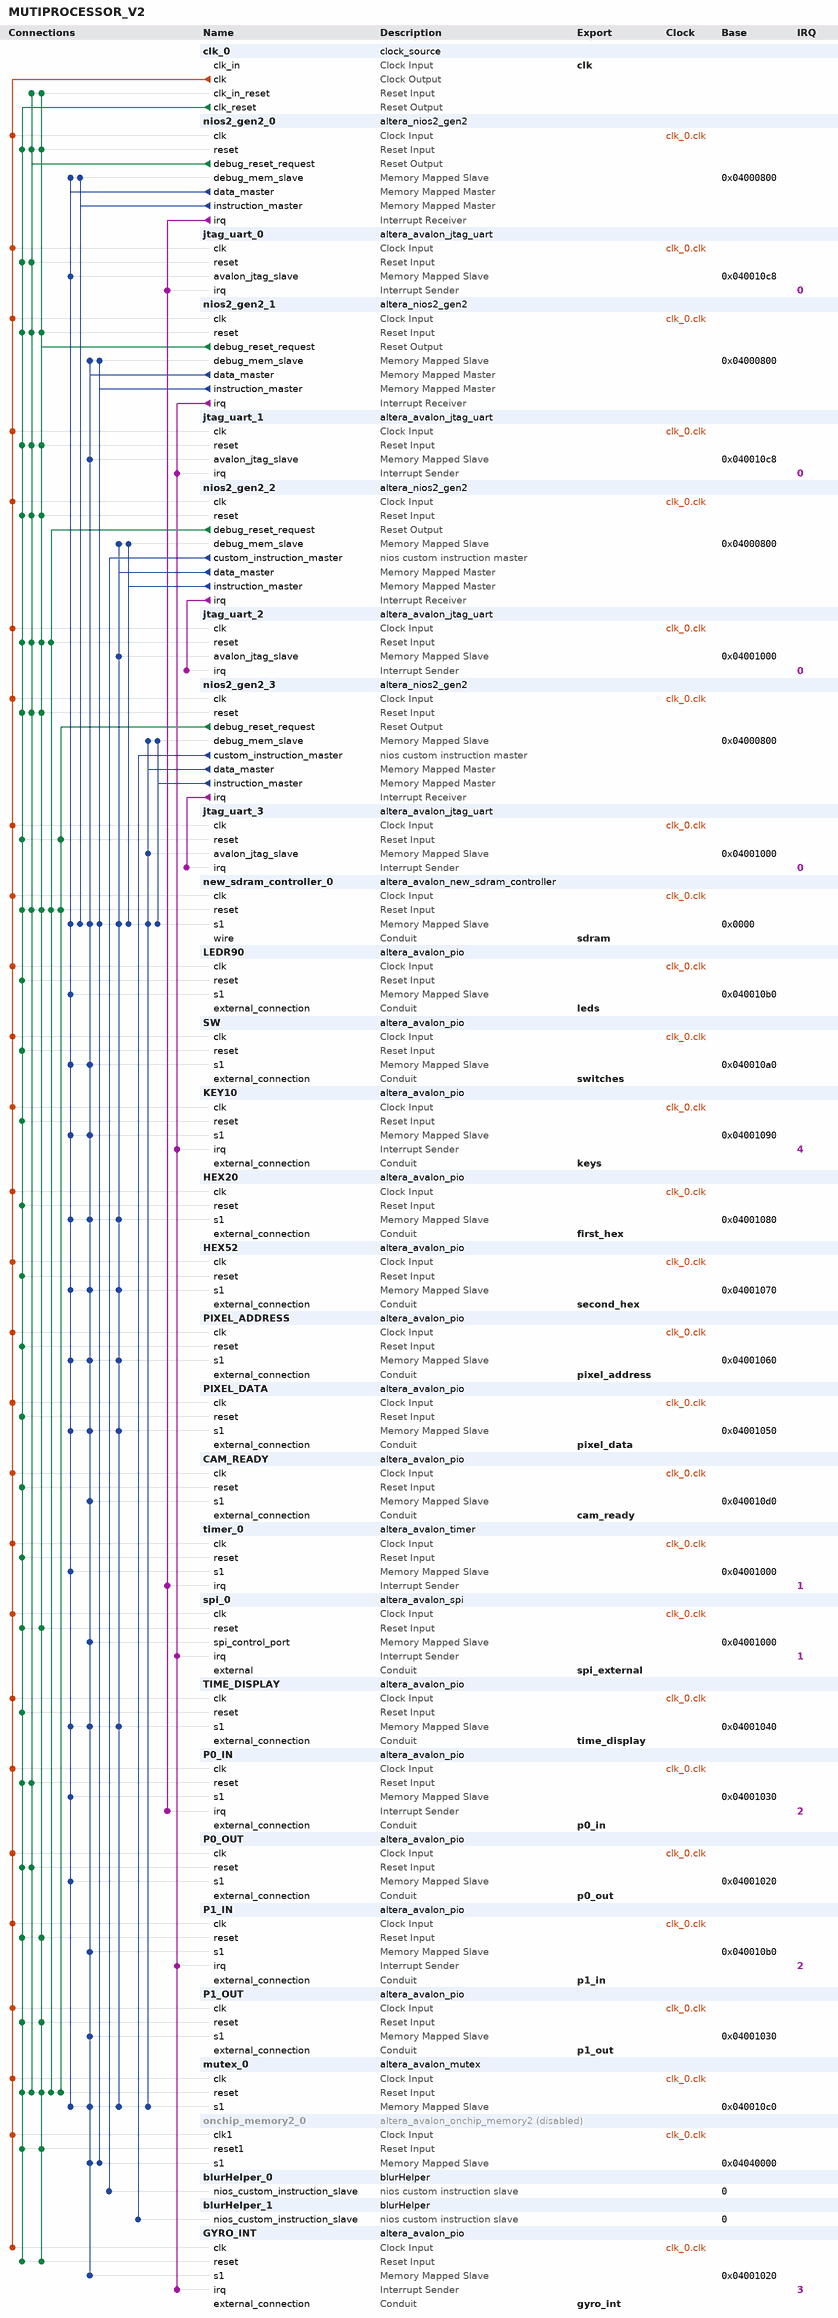
[diagram p0: system contents]
# Platform Designer (Qsys) system MUTIPROCESSOR_V2, MAX 10 10M50DAF484C7G
# Parameters at their usual value, and those the tool derives, are not listed.
package require -exact qsys 18.1
create_system MUTIPROCESSOR_V2
set_project_property DEVICE_FAMILY {MAX 10}
set_project_property DEVICE 10M50DAF484C7G

add_instance clk_0 clock_source 18.1
set_instance_parameter_value clk_0 clockFrequency 50000000

add_instance nios2_gen2_0 altera_nios2_gen2 18.1
set_instance_parameter_value nios2_gen2_0 dcache_size 16384
set_instance_parameter_value nios2_gen2_0 exceptionSlave new_sdram_controller_0.s1
set_instance_parameter_value nios2_gen2_0 icache_size 16384
set_instance_parameter_value nios2_gen2_0 impl Fast
set_instance_parameter_value nios2_gen2_0 resetSlave new_sdram_controller_0.s1

add_instance jtag_uart_0 altera_avalon_jtag_uart 18.1
set_instance_parameter_value jtag_uart_0 readBufferDepth 256
set_instance_parameter_value jtag_uart_0 simInteractiveOptions NO_INTERACTIVE_WINDOWS
set_instance_parameter_value jtag_uart_0 writeBufferDepth 256

add_instance nios2_gen2_1 altera_nios2_gen2 18.1
set_instance_parameter_value nios2_gen2_1 cpuID 1
set_instance_parameter_value nios2_gen2_1 dcache_size 4096
set_instance_parameter_value nios2_gen2_1 exceptionOffset 16777248
set_instance_parameter_value nios2_gen2_1 exceptionSlave new_sdram_controller_0.s1
set_instance_parameter_value nios2_gen2_1 icache_size 2048
set_instance_parameter_value nios2_gen2_1 impl Fast
set_instance_parameter_value nios2_gen2_1 resetOffset 16777216
set_instance_parameter_value nios2_gen2_1 resetSlave new_sdram_controller_0.s1

add_instance jtag_uart_1 altera_avalon_jtag_uart 18.1
set_instance_parameter_value jtag_uart_1 readBufferDepth 256
set_instance_parameter_value jtag_uart_1 simInteractiveOptions NO_INTERACTIVE_WINDOWS
set_instance_parameter_value jtag_uart_1 writeBufferDepth 256

add_instance nios2_gen2_2 altera_nios2_gen2 18.1
set_instance_parameter_value nios2_gen2_2 cpuID 2
set_instance_parameter_value nios2_gen2_2 dcache_size 8192
set_instance_parameter_value nios2_gen2_2 exceptionOffset 20971552
set_instance_parameter_value nios2_gen2_2 exceptionSlave new_sdram_controller_0.s1
set_instance_parameter_value nios2_gen2_2 icache_size 4096
set_instance_parameter_value nios2_gen2_2 impl Fast
set_instance_parameter_value nios2_gen2_2 resetOffset 20971520
set_instance_parameter_value nios2_gen2_2 resetSlave new_sdram_controller_0.s1

add_instance jtag_uart_2 altera_avalon_jtag_uart 18.1
set_instance_parameter_value jtag_uart_2 readBufferDepth 256
set_instance_parameter_value jtag_uart_2 simInteractiveOptions NO_INTERACTIVE_WINDOWS
set_instance_parameter_value jtag_uart_2 writeBufferDepth 256

add_instance nios2_gen2_3 altera_nios2_gen2 18.1
set_instance_parameter_value nios2_gen2_3 cpuID 3
set_instance_parameter_value nios2_gen2_3 dcache_size 8192
set_instance_parameter_value nios2_gen2_3 exceptionOffset 29360160
set_instance_parameter_value nios2_gen2_3 exceptionSlave new_sdram_controller_0.s1
set_instance_parameter_value nios2_gen2_3 icache_size 4096
set_instance_parameter_value nios2_gen2_3 impl Fast
set_instance_parameter_value nios2_gen2_3 resetOffset 29360128
set_instance_parameter_value nios2_gen2_3 resetSlave new_sdram_controller_0.s1

add_instance jtag_uart_3 altera_avalon_jtag_uart 18.1
set_instance_parameter_value jtag_uart_3 readBufferDepth 256
set_instance_parameter_value jtag_uart_3 simInteractiveOptions NO_INTERACTIVE_WINDOWS
set_instance_parameter_value jtag_uart_3 writeBufferDepth 256

add_instance new_sdram_controller_0 altera_avalon_new_sdram_controller 18.1
set_instance_parameter_value new_sdram_controller_0 TAC 5.5
set_instance_parameter_value new_sdram_controller_0 TRCD 20.0
set_instance_parameter_value new_sdram_controller_0 TRP 20.0
set_instance_parameter_value new_sdram_controller_0 casLatency 1
set_instance_parameter_value new_sdram_controller_0 columnWidth 10
set_instance_parameter_value new_sdram_controller_0 dataWidth 16
set_instance_parameter_value new_sdram_controller_0 generateSimulationModel false
set_instance_parameter_value new_sdram_controller_0 model single_Micron_MT48LC4M32B2_7_chip
set_instance_parameter_value new_sdram_controller_0 numberOfBanks 4
set_instance_parameter_value new_sdram_controller_0 numberOfChipSelects 1
set_instance_parameter_value new_sdram_controller_0 powerUpDelay 100.0
set_instance_parameter_value new_sdram_controller_0 refreshPeriod 15.625
set_instance_parameter_value new_sdram_controller_0 rowWidth 13

add_instance LEDR90 altera_avalon_pio 18.1
set_instance_parameter_value LEDR90 direction Output
set_instance_parameter_value LEDR90 width 10

add_instance SW altera_avalon_pio 18.1
set_instance_parameter_value SW direction Input
set_instance_parameter_value SW width 10

add_instance KEY10 altera_avalon_pio 18.1
set_instance_parameter_value KEY10 captureEdge true
set_instance_parameter_value KEY10 direction Input
set_instance_parameter_value KEY10 edgeType FALLING
set_instance_parameter_value KEY10 generateIRQ true
set_instance_parameter_value KEY10 irqType EDGE
set_instance_parameter_value KEY10 width 2

add_instance HEX20 altera_avalon_pio 18.1
set_instance_parameter_value HEX20 direction Output
set_instance_parameter_value HEX20 width 24

add_instance HEX52 altera_avalon_pio 18.1
set_instance_parameter_value HEX52 direction Output
set_instance_parameter_value HEX52 width 24

add_instance PIXEL_ADDRESS altera_avalon_pio 18.1
set_instance_parameter_value PIXEL_ADDRESS direction Output
set_instance_parameter_value PIXEL_ADDRESS width 17

add_instance PIXEL_DATA altera_avalon_pio 18.1
set_instance_parameter_value PIXEL_DATA direction Output
set_instance_parameter_value PIXEL_DATA width 4

add_instance CAM_READY altera_avalon_pio 18.1
set_instance_parameter_value CAM_READY direction Input
set_instance_parameter_value CAM_READY width 1

add_instance timer_0 altera_avalon_timer 18.1
set_instance_parameter_value timer_0 period 1
set_instance_parameter_value timer_0 periodUnits MSEC

add_instance spi_0 altera_avalon_spi 18.1
set_instance_parameter_value spi_0 clockPhase 1
set_instance_parameter_value spi_0 clockPolarity 1
set_instance_parameter_value spi_0 dataWidth 8
set_instance_parameter_value spi_0 masterSPI true
set_instance_parameter_value spi_0 numberOfSlaves 2
set_instance_parameter_value spi_0 targetClockRate 5000000

add_instance TIME_DISPLAY altera_avalon_pio 18.1
set_instance_parameter_value TIME_DISPLAY direction Input
set_instance_parameter_value TIME_DISPLAY width 32

add_instance P0_IN altera_avalon_pio 18.1
set_instance_parameter_value P0_IN bitClearingEdgeCapReg true
set_instance_parameter_value P0_IN captureEdge true
set_instance_parameter_value P0_IN direction Input
set_instance_parameter_value P0_IN generateIRQ true
set_instance_parameter_value P0_IN irqType EDGE
set_instance_parameter_value P0_IN width 1

add_instance P0_OUT altera_avalon_pio 18.1
set_instance_parameter_value P0_OUT direction Output
set_instance_parameter_value P0_OUT width 1

add_instance P1_IN altera_avalon_pio 18.1
set_instance_parameter_value P1_IN bitClearingEdgeCapReg true
set_instance_parameter_value P1_IN captureEdge true
set_instance_parameter_value P1_IN direction Input
set_instance_parameter_value P1_IN generateIRQ true
set_instance_parameter_value P1_IN irqType EDGE
set_instance_parameter_value P1_IN width 1

add_instance P1_OUT altera_avalon_pio 18.1
set_instance_parameter_value P1_OUT direction Output
set_instance_parameter_value P1_OUT width 1

add_instance mutex_0 altera_avalon_mutex 18.1

add_instance onchip_memory2_0 altera_avalon_onchip_memory2 18.1
set_instance_property onchip_memory2_0 ENABLED false
set_instance_parameter_value onchip_memory2_0 dataWidth 32
set_instance_parameter_value onchip_memory2_0 dualPort false
set_instance_parameter_value onchip_memory2_0 initMemContent false
set_instance_parameter_value onchip_memory2_0 initializationFileName onchip_mem.hex
set_instance_parameter_value onchip_memory2_0 memorySize 102400

add_instance blurHelper_0 blurHelper 1.0

add_instance blurHelper_1 blurHelper 1.0

add_instance GYRO_INT altera_avalon_pio 18.1
set_instance_parameter_value GYRO_INT captureEdge true
set_instance_parameter_value GYRO_INT direction Input
set_instance_parameter_value GYRO_INT generateIRQ true
set_instance_parameter_value GYRO_INT irqType EDGE
set_instance_parameter_value GYRO_INT width 1

# connections
add_connection clk_0.clk CAM_READY.clk clock
add_connection clk_0.clk GYRO_INT.clk clock
add_connection clk_0.clk HEX20.clk clock
add_connection clk_0.clk HEX52.clk clock
add_connection clk_0.clk jtag_uart_0.clk clock
add_connection clk_0.clk jtag_uart_1.clk clock
add_connection clk_0.clk jtag_uart_2.clk clock
add_connection clk_0.clk jtag_uart_3.clk clock
add_connection clk_0.clk KEY10.clk clock
add_connection clk_0.clk LEDR90.clk clock
add_connection clk_0.clk mutex_0.clk clock
add_connection clk_0.clk new_sdram_controller_0.clk clock
add_connection clk_0.clk nios2_gen2_0.clk clock
add_connection clk_0.clk nios2_gen2_1.clk clock
add_connection clk_0.clk nios2_gen2_2.clk clock
add_connection clk_0.clk nios2_gen2_3.clk clock
add_connection clk_0.clk onchip_memory2_0.clk1 clock
add_connection clk_0.clk P0_IN.clk clock
add_connection clk_0.clk P0_OUT.clk clock
add_connection clk_0.clk P1_IN.clk clock
add_connection clk_0.clk P1_OUT.clk clock
add_connection clk_0.clk PIXEL_ADDRESS.clk clock
add_connection clk_0.clk PIXEL_DATA.clk clock
add_connection clk_0.clk spi_0.clk clock
add_connection clk_0.clk SW.clk clock
add_connection clk_0.clk TIME_DISPLAY.clk clock
add_connection clk_0.clk timer_0.clk clock
add_connection clk_0.clk_reset CAM_READY.reset reset
add_connection clk_0.clk_reset GYRO_INT.reset reset
add_connection clk_0.clk_reset HEX20.reset reset
add_connection clk_0.clk_reset HEX52.reset reset
add_connection clk_0.clk_reset jtag_uart_0.reset reset
add_connection clk_0.clk_reset jtag_uart_1.reset reset
add_connection clk_0.clk_reset jtag_uart_2.reset reset
add_connection clk_0.clk_reset jtag_uart_3.reset reset
add_connection clk_0.clk_reset KEY10.reset reset
add_connection clk_0.clk_reset LEDR90.reset reset
add_connection clk_0.clk_reset mutex_0.reset reset
add_connection clk_0.clk_reset new_sdram_controller_0.reset reset
add_connection clk_0.clk_reset nios2_gen2_0.reset reset
add_connection clk_0.clk_reset nios2_gen2_1.reset reset
add_connection clk_0.clk_reset nios2_gen2_2.reset reset
add_connection clk_0.clk_reset nios2_gen2_3.reset reset
add_connection clk_0.clk_reset onchip_memory2_0.reset1 reset
add_connection clk_0.clk_reset P0_IN.reset reset
add_connection clk_0.clk_reset P0_OUT.reset reset
add_connection clk_0.clk_reset P1_IN.reset reset
add_connection clk_0.clk_reset P1_OUT.reset reset
add_connection clk_0.clk_reset PIXEL_ADDRESS.reset reset
add_connection clk_0.clk_reset PIXEL_DATA.reset reset
add_connection clk_0.clk_reset spi_0.reset reset
add_connection clk_0.clk_reset SW.reset reset
add_connection clk_0.clk_reset TIME_DISPLAY.reset reset
add_connection clk_0.clk_reset timer_0.reset reset
add_connection nios2_gen2_0.debug_reset_request clk_0.clk_in_reset reset
add_connection nios2_gen2_0.debug_reset_request jtag_uart_0.reset reset
add_connection nios2_gen2_0.debug_reset_request jtag_uart_1.reset reset
add_connection nios2_gen2_0.debug_reset_request jtag_uart_2.reset reset
add_connection nios2_gen2_0.debug_reset_request mutex_0.reset reset
add_connection nios2_gen2_0.debug_reset_request new_sdram_controller_0.reset reset
add_connection nios2_gen2_0.debug_reset_request nios2_gen2_0.reset reset
add_connection nios2_gen2_0.debug_reset_request nios2_gen2_1.reset reset
add_connection nios2_gen2_0.debug_reset_request nios2_gen2_2.reset reset
add_connection nios2_gen2_0.debug_reset_request nios2_gen2_3.reset reset
add_connection nios2_gen2_0.debug_reset_request P0_IN.reset reset
add_connection nios2_gen2_0.debug_reset_request P0_OUT.reset reset
add_connection nios2_gen2_1.debug_reset_request clk_0.clk_in_reset reset
add_connection nios2_gen2_1.debug_reset_request GYRO_INT.reset reset
add_connection nios2_gen2_1.debug_reset_request jtag_uart_1.reset reset
add_connection nios2_gen2_1.debug_reset_request jtag_uart_2.reset reset
add_connection nios2_gen2_1.debug_reset_request mutex_0.reset reset
add_connection nios2_gen2_1.debug_reset_request new_sdram_controller_0.reset reset
add_connection nios2_gen2_1.debug_reset_request nios2_gen2_0.reset reset
add_connection nios2_gen2_1.debug_reset_request nios2_gen2_1.reset reset
add_connection nios2_gen2_1.debug_reset_request nios2_gen2_2.reset reset
add_connection nios2_gen2_1.debug_reset_request nios2_gen2_3.reset reset
add_connection nios2_gen2_1.debug_reset_request onchip_memory2_0.reset1 reset
add_connection nios2_gen2_1.debug_reset_request P1_IN.reset reset
add_connection nios2_gen2_1.debug_reset_request P1_OUT.reset reset
add_connection nios2_gen2_1.debug_reset_request spi_0.reset reset
add_connection nios2_gen2_2.debug_reset_request jtag_uart_2.reset reset
add_connection nios2_gen2_2.debug_reset_request mutex_0.reset reset
add_connection nios2_gen2_2.debug_reset_request new_sdram_controller_0.reset reset
add_connection nios2_gen2_3.debug_reset_request jtag_uart_3.reset reset
add_connection nios2_gen2_3.debug_reset_request mutex_0.reset reset
add_connection nios2_gen2_3.debug_reset_request new_sdram_controller_0.reset reset
add_connection nios2_gen2_0.data_master HEX20.s1 avalon
set_connection_parameter_value nios2_gen2_0.data_master/HEX20.s1 baseAddress 0x04001080
add_connection nios2_gen2_0.data_master HEX52.s1 avalon
set_connection_parameter_value nios2_gen2_0.data_master/HEX52.s1 baseAddress 0x04001070
add_connection nios2_gen2_0.data_master jtag_uart_0.avalon_jtag_slave avalon
set_connection_parameter_value nios2_gen2_0.data_master/jtag_uart_0.avalon_jtag_slave baseAddress 0x040010c8
add_connection nios2_gen2_0.data_master KEY10.s1 avalon
set_connection_parameter_value nios2_gen2_0.data_master/KEY10.s1 baseAddress 0x04001090
add_connection nios2_gen2_0.data_master LEDR90.s1 avalon
set_connection_parameter_value nios2_gen2_0.data_master/LEDR90.s1 baseAddress 0x040010b0
add_connection nios2_gen2_0.data_master mutex_0.s1 avalon
set_connection_parameter_value nios2_gen2_0.data_master/mutex_0.s1 baseAddress 0x040010c0
add_connection nios2_gen2_0.data_master new_sdram_controller_0.s1 avalon
set_connection_parameter_value nios2_gen2_0.data_master/new_sdram_controller_0.s1 baseAddress 0x0000
add_connection nios2_gen2_0.data_master nios2_gen2_0.debug_mem_slave avalon
set_connection_parameter_value nios2_gen2_0.data_master/nios2_gen2_0.debug_mem_slave baseAddress 0x04000800
add_connection nios2_gen2_0.data_master P0_IN.s1 avalon
set_connection_parameter_value nios2_gen2_0.data_master/P0_IN.s1 baseAddress 0x04001030
add_connection nios2_gen2_0.data_master P0_OUT.s1 avalon
set_connection_parameter_value nios2_gen2_0.data_master/P0_OUT.s1 baseAddress 0x04001020
add_connection nios2_gen2_0.data_master PIXEL_ADDRESS.s1 avalon
set_connection_parameter_value nios2_gen2_0.data_master/PIXEL_ADDRESS.s1 baseAddress 0x04001060
add_connection nios2_gen2_0.data_master PIXEL_DATA.s1 avalon
set_connection_parameter_value nios2_gen2_0.data_master/PIXEL_DATA.s1 baseAddress 0x04001050
add_connection nios2_gen2_0.data_master SW.s1 avalon
set_connection_parameter_value nios2_gen2_0.data_master/SW.s1 baseAddress 0x040010a0
add_connection nios2_gen2_0.data_master TIME_DISPLAY.s1 avalon
set_connection_parameter_value nios2_gen2_0.data_master/TIME_DISPLAY.s1 baseAddress 0x04001040
add_connection nios2_gen2_0.data_master timer_0.s1 avalon
set_connection_parameter_value nios2_gen2_0.data_master/timer_0.s1 baseAddress 0x04001000
add_connection nios2_gen2_0.instruction_master new_sdram_controller_0.s1 avalon
set_connection_parameter_value nios2_gen2_0.instruction_master/new_sdram_controller_0.s1 baseAddress 0x0000
add_connection nios2_gen2_0.instruction_master nios2_gen2_0.debug_mem_slave avalon
set_connection_parameter_value nios2_gen2_0.instruction_master/nios2_gen2_0.debug_mem_slave baseAddress 0x04000800
add_connection nios2_gen2_1.data_master CAM_READY.s1 avalon
set_connection_parameter_value nios2_gen2_1.data_master/CAM_READY.s1 baseAddress 0x040010d0
add_connection nios2_gen2_1.data_master GYRO_INT.s1 avalon
set_connection_parameter_value nios2_gen2_1.data_master/GYRO_INT.s1 baseAddress 0x04001020
add_connection nios2_gen2_1.data_master HEX20.s1 avalon
set_connection_parameter_value nios2_gen2_1.data_master/HEX20.s1 baseAddress 0x04001080
add_connection nios2_gen2_1.data_master HEX52.s1 avalon
set_connection_parameter_value nios2_gen2_1.data_master/HEX52.s1 baseAddress 0x04001070
add_connection nios2_gen2_1.data_master jtag_uart_1.avalon_jtag_slave avalon
set_connection_parameter_value nios2_gen2_1.data_master/jtag_uart_1.avalon_jtag_slave baseAddress 0x040010c8
add_connection nios2_gen2_1.data_master KEY10.s1 avalon
set_connection_parameter_value nios2_gen2_1.data_master/KEY10.s1 baseAddress 0x04001090
add_connection nios2_gen2_1.data_master mutex_0.s1 avalon
set_connection_parameter_value nios2_gen2_1.data_master/mutex_0.s1 baseAddress 0x040010c0
add_connection nios2_gen2_1.data_master new_sdram_controller_0.s1 avalon
set_connection_parameter_value nios2_gen2_1.data_master/new_sdram_controller_0.s1 baseAddress 0x0000
add_connection nios2_gen2_1.data_master nios2_gen2_1.debug_mem_slave avalon
set_connection_parameter_value nios2_gen2_1.data_master/nios2_gen2_1.debug_mem_slave baseAddress 0x04000800
add_connection nios2_gen2_1.data_master onchip_memory2_0.s1 avalon
set_connection_parameter_value nios2_gen2_1.data_master/onchip_memory2_0.s1 baseAddress 0x04040000
add_connection nios2_gen2_1.data_master P1_IN.s1 avalon
set_connection_parameter_value nios2_gen2_1.data_master/P1_IN.s1 baseAddress 0x040010b0
add_connection nios2_gen2_1.data_master P1_OUT.s1 avalon
set_connection_parameter_value nios2_gen2_1.data_master/P1_OUT.s1 baseAddress 0x04001030
add_connection nios2_gen2_1.data_master PIXEL_ADDRESS.s1 avalon
set_connection_parameter_value nios2_gen2_1.data_master/PIXEL_ADDRESS.s1 baseAddress 0x04001060
add_connection nios2_gen2_1.data_master PIXEL_DATA.s1 avalon
set_connection_parameter_value nios2_gen2_1.data_master/PIXEL_DATA.s1 baseAddress 0x04001050
add_connection nios2_gen2_1.data_master spi_0.spi_control_port avalon
set_connection_parameter_value nios2_gen2_1.data_master/spi_0.spi_control_port baseAddress 0x04001000
add_connection nios2_gen2_1.data_master SW.s1 avalon
set_connection_parameter_value nios2_gen2_1.data_master/SW.s1 baseAddress 0x040010a0
add_connection nios2_gen2_1.data_master TIME_DISPLAY.s1 avalon
set_connection_parameter_value nios2_gen2_1.data_master/TIME_DISPLAY.s1 baseAddress 0x04001040
add_connection nios2_gen2_1.instruction_master new_sdram_controller_0.s1 avalon
set_connection_parameter_value nios2_gen2_1.instruction_master/new_sdram_controller_0.s1 baseAddress 0x0000
add_connection nios2_gen2_1.instruction_master nios2_gen2_1.debug_mem_slave avalon
set_connection_parameter_value nios2_gen2_1.instruction_master/nios2_gen2_1.debug_mem_slave baseAddress 0x04000800
add_connection nios2_gen2_1.instruction_master onchip_memory2_0.s1 avalon
set_connection_parameter_value nios2_gen2_1.instruction_master/onchip_memory2_0.s1 baseAddress 0x04040000
add_connection nios2_gen2_2.data_master HEX20.s1 avalon
set_connection_parameter_value nios2_gen2_2.data_master/HEX20.s1 baseAddress 0x04001080
add_connection nios2_gen2_2.data_master HEX52.s1 avalon
set_connection_parameter_value nios2_gen2_2.data_master/HEX52.s1 baseAddress 0x04001070
add_connection nios2_gen2_2.data_master jtag_uart_2.avalon_jtag_slave avalon
set_connection_parameter_value nios2_gen2_2.data_master/jtag_uart_2.avalon_jtag_slave baseAddress 0x04001000
add_connection nios2_gen2_2.data_master mutex_0.s1 avalon
set_connection_parameter_value nios2_gen2_2.data_master/mutex_0.s1 baseAddress 0x040010c0
add_connection nios2_gen2_2.data_master new_sdram_controller_0.s1 avalon
set_connection_parameter_value nios2_gen2_2.data_master/new_sdram_controller_0.s1 baseAddress 0x0000
add_connection nios2_gen2_2.data_master nios2_gen2_2.debug_mem_slave avalon
set_connection_parameter_value nios2_gen2_2.data_master/nios2_gen2_2.debug_mem_slave baseAddress 0x04000800
add_connection nios2_gen2_2.data_master PIXEL_ADDRESS.s1 avalon
set_connection_parameter_value nios2_gen2_2.data_master/PIXEL_ADDRESS.s1 baseAddress 0x04001060
add_connection nios2_gen2_2.data_master PIXEL_DATA.s1 avalon
set_connection_parameter_value nios2_gen2_2.data_master/PIXEL_DATA.s1 baseAddress 0x04001050
add_connection nios2_gen2_2.data_master TIME_DISPLAY.s1 avalon
set_connection_parameter_value nios2_gen2_2.data_master/TIME_DISPLAY.s1 baseAddress 0x04001040
add_connection nios2_gen2_2.instruction_master new_sdram_controller_0.s1 avalon
set_connection_parameter_value nios2_gen2_2.instruction_master/new_sdram_controller_0.s1 baseAddress 0x0000
add_connection nios2_gen2_2.instruction_master nios2_gen2_2.debug_mem_slave avalon
set_connection_parameter_value nios2_gen2_2.instruction_master/nios2_gen2_2.debug_mem_slave baseAddress 0x04000800
add_connection nios2_gen2_3.data_master jtag_uart_3.avalon_jtag_slave avalon
set_connection_parameter_value nios2_gen2_3.data_master/jtag_uart_3.avalon_jtag_slave baseAddress 0x04001000
add_connection nios2_gen2_3.data_master mutex_0.s1 avalon
set_connection_parameter_value nios2_gen2_3.data_master/mutex_0.s1 baseAddress 0x040010c0
add_connection nios2_gen2_3.data_master new_sdram_controller_0.s1 avalon
set_connection_parameter_value nios2_gen2_3.data_master/new_sdram_controller_0.s1 baseAddress 0x0000
add_connection nios2_gen2_3.data_master nios2_gen2_3.debug_mem_slave avalon
set_connection_parameter_value nios2_gen2_3.data_master/nios2_gen2_3.debug_mem_slave baseAddress 0x04000800
add_connection nios2_gen2_3.instruction_master new_sdram_controller_0.s1 avalon
set_connection_parameter_value nios2_gen2_3.instruction_master/new_sdram_controller_0.s1 baseAddress 0x0000
add_connection nios2_gen2_3.instruction_master nios2_gen2_3.debug_mem_slave avalon
set_connection_parameter_value nios2_gen2_3.instruction_master/nios2_gen2_3.debug_mem_slave baseAddress 0x04000800
add_connection nios2_gen2_0.irq jtag_uart_0.irq interrupt
set_connection_parameter_value nios2_gen2_0.irq/jtag_uart_0.irq irqNumber 0
add_connection nios2_gen2_0.irq P0_IN.irq interrupt
set_connection_parameter_value nios2_gen2_0.irq/P0_IN.irq irqNumber 2
add_connection nios2_gen2_0.irq timer_0.irq interrupt
set_connection_parameter_value nios2_gen2_0.irq/timer_0.irq irqNumber 1
add_connection nios2_gen2_1.irq GYRO_INT.irq interrupt
set_connection_parameter_value nios2_gen2_1.irq/GYRO_INT.irq irqNumber 3
add_connection nios2_gen2_1.irq jtag_uart_1.irq interrupt
set_connection_parameter_value nios2_gen2_1.irq/jtag_uart_1.irq irqNumber 0
add_connection nios2_gen2_1.irq KEY10.irq interrupt
set_connection_parameter_value nios2_gen2_1.irq/KEY10.irq irqNumber 4
add_connection nios2_gen2_1.irq P1_IN.irq interrupt
set_connection_parameter_value nios2_gen2_1.irq/P1_IN.irq irqNumber 2
add_connection nios2_gen2_1.irq spi_0.irq interrupt
set_connection_parameter_value nios2_gen2_1.irq/spi_0.irq irqNumber 1
add_connection nios2_gen2_2.irq jtag_uart_2.irq interrupt
set_connection_parameter_value nios2_gen2_2.irq/jtag_uart_2.irq irqNumber 0
add_connection nios2_gen2_3.irq jtag_uart_3.irq interrupt
set_connection_parameter_value nios2_gen2_3.irq/jtag_uart_3.irq irqNumber 0
add_connection nios2_gen2_2.custom_instruction_master blurHelper_0.nios_custom_instruction_slave nios_custom_instruction
set_connection_parameter_value nios2_gen2_2.custom_instruction_master/blurHelper_0.nios_custom_instruction_slave CIName blurhelper_0
set_connection_parameter_value nios2_gen2_2.custom_instruction_master/blurHelper_0.nios_custom_instruction_slave baseAddress 0
add_connection nios2_gen2_3.custom_instruction_master blurHelper_1.nios_custom_instruction_slave nios_custom_instruction
set_connection_parameter_value nios2_gen2_3.custom_instruction_master/blurHelper_1.nios_custom_instruction_slave CIName blurhelper_1
set_connection_parameter_value nios2_gen2_3.custom_instruction_master/blurHelper_1.nios_custom_instruction_slave baseAddress 0

# exported interfaces
add_interface cam_ready conduit end
set_interface_property cam_ready EXPORT_OF CAM_READY.external_connection
add_interface clk clock sink
set_interface_property clk EXPORT_OF clk_0.clk_in
add_interface first_hex conduit end
set_interface_property first_hex EXPORT_OF HEX20.external_connection
add_interface gyro_int conduit end
set_interface_property gyro_int EXPORT_OF GYRO_INT.external_connection
add_interface keys conduit end
set_interface_property keys EXPORT_OF KEY10.external_connection
add_interface leds conduit end
set_interface_property leds EXPORT_OF LEDR90.external_connection
add_interface p0_in conduit end
set_interface_property p0_in EXPORT_OF P0_IN.external_connection
add_interface p0_out conduit end
set_interface_property p0_out EXPORT_OF P0_OUT.external_connection
add_interface p1_in conduit end
set_interface_property p1_in EXPORT_OF P1_IN.external_connection
add_interface p1_out conduit end
set_interface_property p1_out EXPORT_OF P1_OUT.external_connection
add_interface pixel_address conduit end
set_interface_property pixel_address EXPORT_OF PIXEL_ADDRESS.external_connection
add_interface pixel_data conduit end
set_interface_property pixel_data EXPORT_OF PIXEL_DATA.external_connection
add_interface sdram conduit end
set_interface_property sdram EXPORT_OF new_sdram_controller_0.wire
add_interface second_hex conduit end
set_interface_property second_hex EXPORT_OF HEX52.external_connection
add_interface spi_external conduit end
set_interface_property spi_external EXPORT_OF spi_0.external
add_interface switches conduit end
set_interface_property switches EXPORT_OF SW.external_connection
add_interface time_display conduit end
set_interface_property time_display EXPORT_OF TIME_DISPLAY.external_connection

set_interconnect_requirement {$system} qsys_mm.clockCrossingAdapter HANDSHAKE
set_interconnect_requirement {$system} qsys_mm.enableEccProtection FALSE
set_interconnect_requirement {$system} qsys_mm.insertDefaultSlave FALSE
set_interconnect_requirement {$system} qsys_mm.maxAdditionalLatency 1

save_system MUTIPROCESSOR_V2.qsys
